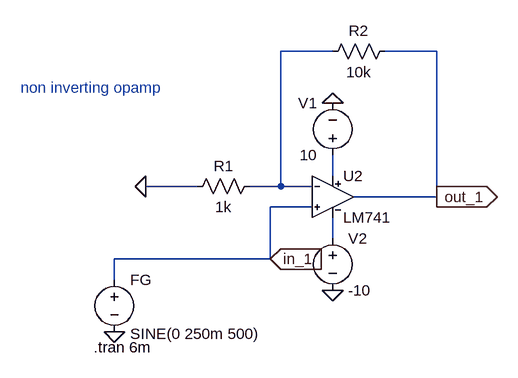
[diagram p0: schematic non_inverting_op.asc]
non_inverting_op.asc, the LTspice schematic file:
Version 4
SHEET 1 1252 1236
WIRE 192 -80 112 -80
WIRE 352 -80 272 -80
WIRE 192 112 192 80
WIRE -16 128 -96 128
WIRE 112 128 112 -80
WIRE 112 128 64 128
WIRE 160 128 112 128
WIRE 352 144 352 -80
WIRE 352 144 224 144
WIRE 160 160 96 160
WIRE 192 208 192 176
WIRE 96 240 96 160
WIRE 96 240 -144 240
WIRE -144 272 -144 240
FLAG 192 0 0
FLAG 192 288 0
FLAG -144 352 0
FLAG -96 128 0
FLAG 96 240 in_1
IOPIN 96 240 In
FLAG 352 144 out_1
IOPIN 352 144 Out
SYMBOL voltage 192 96 R180
WINDOW 0 24 96 Left 2
WINDOW 3 24 16 Left 2
WINDOW 123 0 0 Left 2
WINDOW 39 0 0 Left 2
SYMATTR InstName V1
SYMATTR Value 10
SYMBOL voltage 192 192 R0
WINDOW 123 0 0 Left 2
WINDOW 39 0 0 Left 2
SYMATTR InstName V2
SYMATTR Value -10
SYMBOL voltage -144 256 R0
WINDOW 3 24 99 Left 2
WINDOW 123 0 0 Left 2
WINDOW 39 0 0 Left 2
SYMATTR Value SINE(0 250m 500)
SYMATTR InstName FG
SYMBOL res -32 144 R270
WINDOW 0 32 56 VTop 2
WINDOW 3 0 56 VBottom 2
SYMATTR InstName R1
SYMATTR Value 1k
SYMBOL res 176 -64 R270
WINDOW 0 32 56 VTop 2
WINDOW 3 0 56 VBottom 2
SYMATTR InstName R2
SYMATTR Value 10k
SYMBOL LM741 192 80 R0
SYMATTR InstName U2
TEXT -176 376 Left 2 !.tran 6m
TEXT -288 -24 Left 2 ;non inverting opamp

The netlist it stands for:
* non_inverting_op.asc
V1 N002 0 10
V2 N003 0 -10
V§FG in_1 0 SINE(0 250m 500)
R1 0 N001 1k
R2 N001 out_1 10k
XU2 in_1 N001 N002 N003 out_1 LM741  ; pins In+ In- V+ V- OUT
.tran 6m
* non inverting opamp
.lib LM741.lib
.backanno
.end